# Altium schematic sheet mpu.SchDoc
size A4
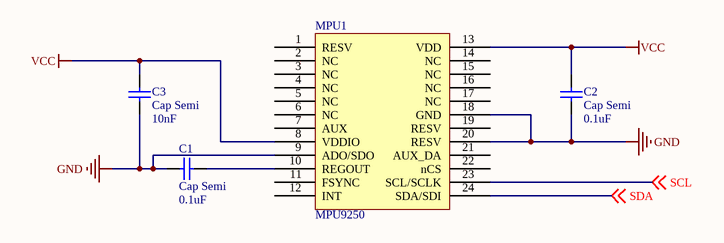
[diagram p0: mpu.SchDoc]

## Parts
C1  Cap Semi  value 0.1uF  [C1206]
C2  Cap Semi  value 0.1uF  [C1206]
C3  Cap Semi  value 10nF  [C1206]
MPU1  MPU9250

## Nets
GND: C1.2 C2.1 C3.2 MPU1.9(ADO/SDO) MPU1.18(GND) MPU1.20(RESV)
VCC: C2.2 C3.1 MPU1.8(VDDIO) MPU1.13(VDD)
SCL: MPU1.23(SCL/SCLK) ; off-sheet SCL
SDA: MPU1.24(SDA/SDI) ; off-sheet SDA
NetC1_1: C1.1 MPU1.10(REGOUT)

Not connected (* = marked no-connect by the designer): MPU1 1(RESV) 2(NC) 3(NC) 4(NC) 5(NC) 6(NC) 7(AUX) 11(FSYNC) 12(INT) 14(NC) 15(NC) 16(NC) 17(NC) 19(RESV) 21(AUX_DA) 22(nCS)

## Library data of the parts
C1-C3 = Cap Semi: Capacitor (Semiconductor SIM Model); Published: 8-Jun-2000; LatestRevisionDate: 29-May-2009; LatestRevisionNote: IPC-7351 Footprint Added.; PackageReference: C1206; Publisher: Altium Limited; PackageDescription: Chip Capacitor